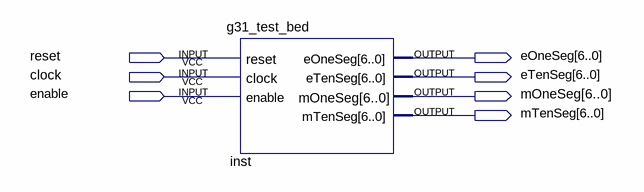
[diagram p0: schematic sheet]
// Quartus schematic g31_test_bed_circuit.bdf as structural Verilog: 1 symbols, 7 pins
module g31_test_bed_circuit (
  input  reset,
  input  clock,
  input  enable,
  output [6:0] eOneSeg,
  output [6:0] eTenSeg,
  output [6:0] mOneSeg,
  output [6:0] mTenSeg
);

  g31_test_bed inst (
    .reset(reset), .clock(clock), .enable(enable), .eOneSeg(eOneSeg), .eTenSeg(eTenSeg), .mOneSeg(mOneSeg),
    .mTenSeg(mTenSeg));
endmodule
